# EasyEDA Pro project f4_ui.eprj

# Schematic Schematic1
Board Name: Board1; Create Date: 2025-08-23; Page Name: P1; Project Name: f4_ui; Schematic Name: Schematic1; Update Date: 2025-08-25; Company: 嘉立创EDA; Page Size: A4; Version: V1.0
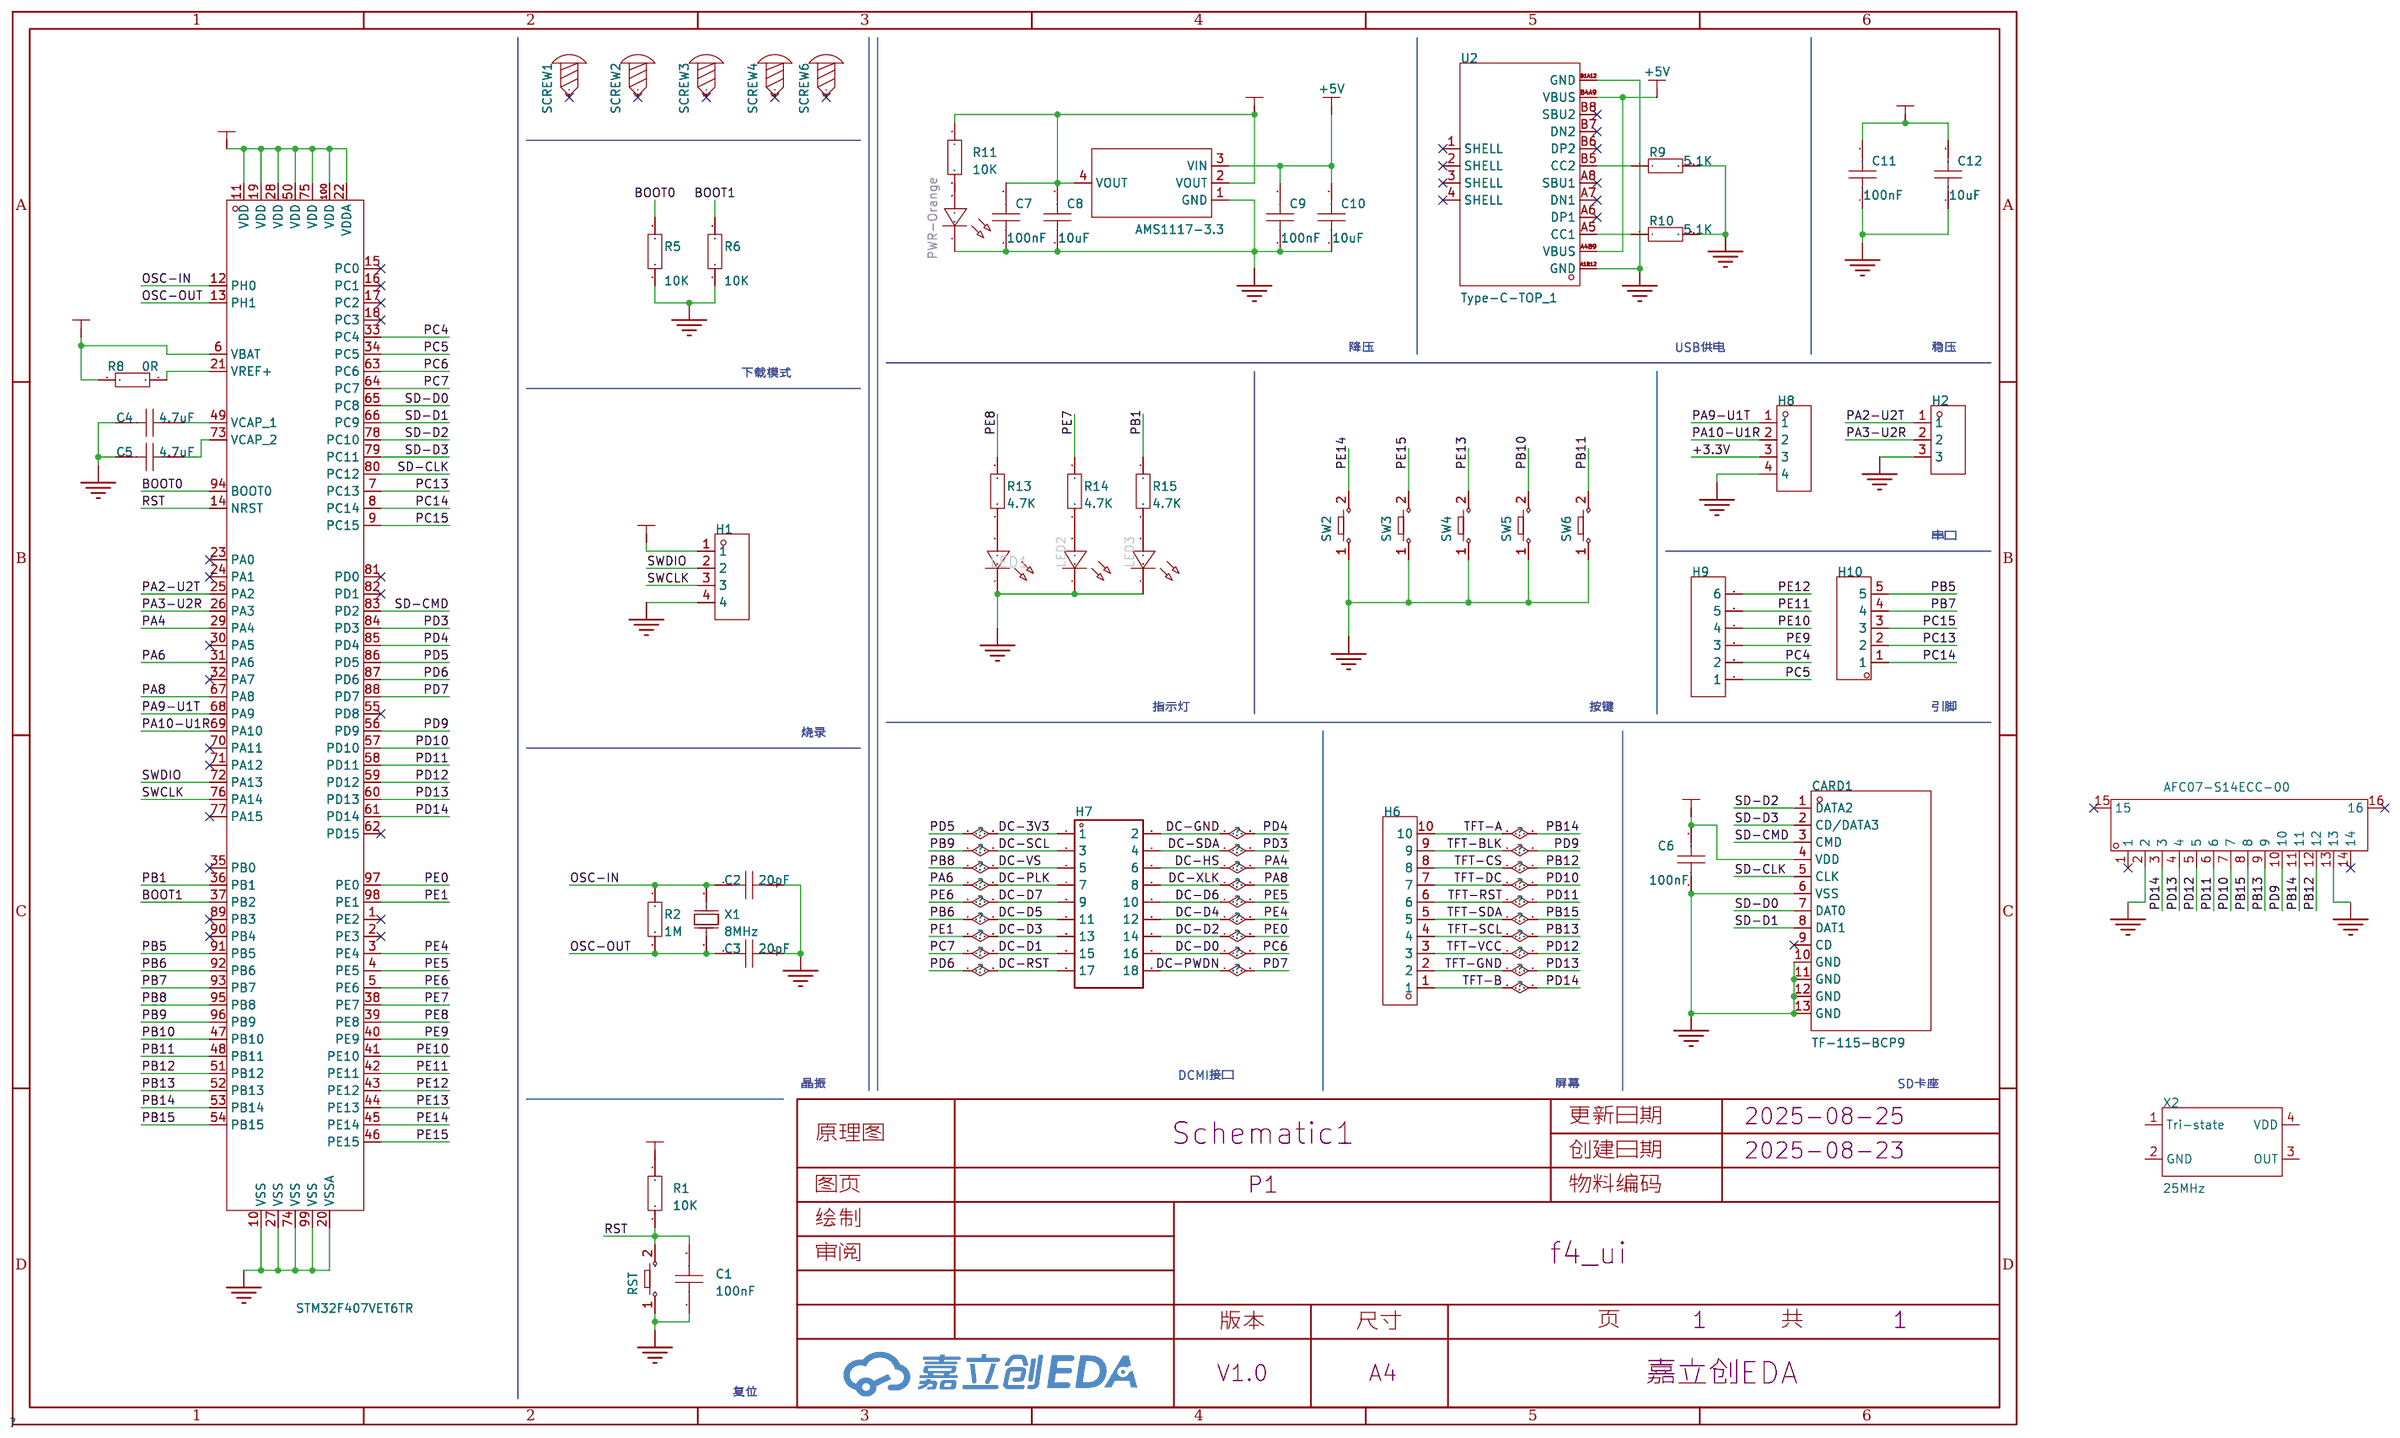
[diagram p0: schematic sheet]

## Parts
C1  100nF  [C0805]
C2  20pF  [C0805]
C3  20pF  [C0805]
C4  4.7uF  [C0805]
C5  4.7uF  [C0805]
C6  100nF  [C0805]
C7  100nF  [C0805]
C8  10uF  [C0805]
C9  100nF  [C0805]
C10  10uF  [C0805]
C11  100nF  [C0805]
C12  10uF  [C0805]
CARD1  TF-115-BCP9  [TF-SMD_TF-115-BCP9]
H1  -  [HDR-TH_4P-P2.54-V-M]
H2  -  [HDR-TH_3P-P2.54-V-F]
H6  -  [HDR-TH_10P-P2.54-V-F]
H7  -  [HDR-TH_18P-P2.54-V-F-R2-C9-S2.54-1]
H8  -  [HDR-TH_4P-P2.54-V-F]
H9  -  [HDR-TH_6P-P2.54-V-M-1]
H10  -  [HDR-TH_5P-P2.54-V-M]
LED1  -  [LED_0805]
LED2  -  [LED_0805]
LED3  -  [LED_0805]
P1  AFC07-S14ECC-00  [FPC-SMD_14P-L12.5-W5.4-P0.50]
PWR-Orange  -  [LED_0805]
R1  10K  [R0805]
R2  1M  [R0805]
R5  10K  [R0805]
R6  10K  [R0805]
R8  0R  [R0805]
R9  5.1K  [R0805]
R10  5.1K  [R0805]
R11  10K  [R0805]
R13  4.7K  [R0805]
R14  4.7K  [R0805]
R15  4.7K  [R0805]
RST  -  [Key_SMD_3x4x2]
SCREW1  -  [M3螺丝]
SCREW2  -  [M3螺丝]
SCREW3  -  [M3螺丝]
SCREW4  -  [M3螺丝]
SCREW6  -  [M3螺丝]
SW2  -  [Key_SMD_3x4x2]
SW3  -  [Key_SMD_3x4x2]
SW4  -  [Key_SMD_3x4x2]
SW5  -  [Key_SMD_3x4x2]
SW6  -  [Key_SMD_3x4x2]
U1  STM32F407VET6TR  [LQFP-100_L14.0-W14.0-P0.50-LS16.0-BL]
U2  Type-C-TOP_1  [USB-C-SMD_TYPE-C16PIN]
U3  AMS1117-3.3  [SOT-223-3_L6.5-W3.4-P2.30-LS7.0-BR]
X1  8MHz  [HC-49S_L11.5-W4.8]
X2  25MHz  [OSC-SMD_4P-L5.0-W3.2-BL_A]

## Library data of the parts
C1-C12 = CAP_0805: Supplier Footprint: 0805
CARD1 = TF-115-BCP9: 卡连接方式:自弹式;卡类型:MicroSD卡(TF卡);连接器类型:卡座;本体最大高度:1.8mm;工作温度范围:-25℃~+85℃;; LCSC Part Name: 自弹式 MicroSD卡(TF卡) 卡座; Supplier Part: C720505; Manufacturer: XUNPU(讯普); Supplier Footprint: SMD; JLCPCB Part Class: 扩展库; Datasheet: https://atta.szlcsc.com/upload/public/pdf/source/20210906/DBEC8F03AA1503572333C7CF4A76D0AD.pdf; Supplier: LCSC; Card Connection Mode: 自弹式; Card Type: MicroSD卡(TF卡); Connector Type: 卡座; Maximum Body Height: 1.8mm; Operating Temperature Range: -25℃~+85℃
H1 = HDR-M_2.54_1x4P: Supplier Part: C492403; Supplier Footprint: 插件
H2 = HDR-F_2.54_1x3P: Supplier Part: C541850; Supplier Footprint: 插件
H6 = HDR-F_2.54_1x10P: Supplier Part: C2684744; Supplier Footprint: 插件
H7 = HDR-F_2.54_2x9: Supplier Part: C132125; Supplier Footprint: 插件
H8 = HDR-F_2.54_1x4P: Supplier Part: C2718488; Supplier Footprint: 插件
H9 = HDR-M_2.54_1x6P: Supplier Part: C37208; Supplier Footprint: 插件
H10 = HDR-M_2.54_1x5P: Supplier Part: C358687; Supplier Footprint: 插件
LED1 = LED_0805-R: Supplier Footprint: 0805
LED2 PWR-Orange = LED_0805-G: Supplier Footprint: 0805
LED3 = LED_0805-B: Supplier Footprint: 0805
P1 = AFC07-S14ECC-00: 锁定特性:抽屉式;触点类型:上接;触点数量:14P;间距:0.5mm;安装类型:卧贴;; LCSC Part Name: 间距:0.5mm P数:14P 抽屉式 上接; Supplier Part: C11087; Manufacturer: JS(钜硕电子); Supplier Footprint: SMD,P=0.5mm,卧贴; JLCPCB Part Class: 扩展库; Datasheet: https://atta.szlcsc.com/upload/public/pdf/source/20130129/1457706582878.pdf; Supplier: LCSC; Locking Feature: 抽屉式; Contact Type: 上接; Number of Contacts: 14P; Pitch: 0.5mm; Mounting Type: 卧贴; FFC, FCB Thickness: 0.3mm; Height Above Board: 2mm
R1 R2 R5 R6 R8-R11 R13-R15 = Res_0805: Supplier Footprint: 0805
RST SW2-SW6 = Key_SMD_3x4x2: Supplier Footprint: SMD
SCREW1-SCREW4 SCREW6 = M3螺丝: Supplier Footprint: 插件
U1 = STM32F407VET6TR: CPU内核:ARM-M4;CPU最大主频:168MHz;应用领域:-;; LCSC Part Name: 带DSP和FPU的高性能基础系列ARM Cortex-M4 MCU，具有512 KB Flash、168 MHz CPU、ART加速器、以太网和FSMC; Supplier Part: C5269943; Manufacturer: ST(意法半导体); Supplier Footprint: LQFP-100(14x14); JLCPCB Part Class: 扩展库; Datasheet: https://atta.szlcsc.com/upload/public/pdf/source/20201130/C919362_39400D478C258148B3DF984CE4A4041A.pdf; Supplier: LCSC; CPU Core: ARM-M4; CPU Maximum Speed: 168MHz; Number of I/O: 82; ADC (Bit): 12bit; DAC (Bit): 12bit; Low Voltage Detection Threshold: 1.8V~3.6V
U2 = Type-C-TOP_1: Supplier Part: C9900005857; Supplier Footprint: Type-C16P; JLCPCB Part Class: 扩展库; Supplier: LCSC
U3 = AMS1117-3.3_C6186: 输出类型:固定;工作电压:-;输出电压:3.3V;输出电流:1A;电源纹波抑制比(PSRR):72dB@(120Hz);输出极性:正极;; LCSC Part Name: 输出3.3V 1A; Supplier Part: C6186; Manufacturer: AMS; Supplier Footprint: SOT-223; JLCPCB Part Class: 基础库; Datasheet: https://atta.szlcsc.com/upload/public/pdf/source/20180727/C6186_7A095716F0823C02F1997A905E26C086.pdf; Supplier: LCSC; Output Type: 固定; Output Voltage: 3.3V; Output Current: 1A; Power Supply Rejection Ratio (PSRR): 72dB@(120Hz); Voltage Dropout: 1.3V@(800mA); Features: 过流保护(OCP)；热关断(TSD); Output Configuration: 正极; Number of Outputs: 1
X1 = 49SAT080000201060: 晶振类型:贴片晶振;频率:8MHz;常温频差:±10ppm;外接负载电容:20pF;; LCSC Part Name: 8MHz ±10ppm 20pF; Supplier Part: C390758; Manufacturer: JGHC(晶光华); Supplier Footprint: HC-49S-SMD; JLCPCB Part Class: 扩展库; Datasheet: https://atta.szlcsc.com/upload/public/pdf/source/20200102/C479159_77354EAC8C21D1127CB2E163DDA33705.pdf; Supplier: LCSC; Crystal Type: 贴片晶振; Normal temperature Frequency Tolerance: ±10ppm; External load capacitor: 20pF; Operating Temperature: -20℃~+70℃
X2 = OT503225MJBA4SL: LCSC Part Name: YSO110TR 25MHZ 4P 5032 1.8V-3.3V ±10PPM -40~85℃（±20PPM) CMOS; Supplier Part: C717795; Manufacturer: YXC(扬兴晶振); Supplier Footprint: SMD5032-4P; JLCPCB Part Class: 扩展库; Datasheet: https://item.szlcsc.com/datasheet/OT503225MJBA4SL/758655.html; Supplier: LCSC; Normal temperature Frequency Tolerance: ±10ppm; Output Type: CMOS; Voltage - Supply: 1.8V~3.3V; Frequency Stability: ±20ppm; Operating Temperature: -40℃~+85℃

## Nets
+3.3V: C6.2 C7.2 C8.2 C11.2 C12.2 CARD1.4(VDD) H1.1 H8.3 R1.2 R8.1 R11.1 U1.6(VBAT) U1.11(VDD) U1.19(VDD) U1.22(VDDA) U1.28(VDD) U1.50(VDD) U1.75(VDD) U1.100(VDD) U3.2(VOUT) U3.4(VOUT)
+5V: C9.2 C10.2 U2.A4B9(VBUS) U2.B4A9(VBUS) U3.3(VIN)
GND: C1.1 C2.2 C3.2 C4.1 C5.1 C6.1 C7.1 C8.1 C9.1 C10.1 C11.1 C12.1 CARD1.6(VSS) CARD1.10(GND) CARD1.11(GND) CARD1.12(GND) CARD1.13(GND) H1.4 H2.3 H8.4 LED1.1(C) LED2.1(C) LED3.1(C) P1.2 P1.13 PWR-Orange.1(C) R5.1 R6.1 R9.2 R10.2 RST.1 SW2.1 SW3.1 SW4.1 SW5.1 SW6.1 U1.10(VSS) U1.20(VSSA) U1.27(VSS) U1.74(VSS) U1.99(VSS) U2.A1B12(GND) U2.B1A12(GND) U3.1(GND)
BOOT0: R5.2 U1.94(BOOT0)
BOOT1: R6.2 U1.37(PB2)
DC-3V3: H7.1 U1.86(PD5)
DC-D0: H7.16 U1.63(PC6)
DC-D1: H7.15 U1.64(PC7)
DC-D2: H7.14 U1.97(PE0)
DC-D3: H7.13 U1.98(PE1)
DC-D4: H7.12 U1.3(PE4)
DC-D5: H7.11 U1.92(PB6)
DC-D6: H7.10 U1.4(PE5)
DC-D7: H7.9 U1.5(PE6)
DC-GND: H7.2 U1.85(PD4)
DC-HS: H7.6 U1.29(PA4)
DC-PLK: H7.7 U1.31(PA6)
DC-PWDN: H7.18 U1.88(PD7)
DC-RST: H7.17 U1.87(PD6)
DC-SCL: H7.3 U1.96(PB9)
DC-SDA: H7.4 U1.84(PD3)
DC-VS: H7.5 U1.95(PB8)
DC-XLK: H7.8 U1.67(PA8)
OSC-IN: C2.1 R2.2 U1.12(PH0) X1.2(OSC2)
OSC-OUT: C3.1 R2.1 U1.13(PH1) X1.1(OSC1)
PA2-U2T: H2.1 U1.25(PA2)
PA3-U2R: H2.2 U1.26(PA3)
PA9-U1T: H8.1 U1.68(PA9)
PA10-U1R: H8.2 U1.69(PA10)
PB1: R15.2 U1.36(PB1)
PB5: H10.5 U1.91(PB5)
PB7: H10.4 U1.93(PB7)
PB10: SW5.2 U1.47(PB10)
PB11: SW6.2 U1.48(PB11)
PB12: H6.8 P1.12 U1.51(PB12)
PB13: H6.4 P1.9 U1.52(PB13)
PB14: H6.10 P1.11 U1.53(PB14)
PB15: H6.5 P1.8 U1.54(PB15)
PC4: H9.2 U1.33(PC4)
PC5: H9.1 U1.34(PC5)
PC13: H10.2 U1.7(PC13)
PC14: H10.1 U1.8(PC14)
PC15: H10.3 U1.9(PC15)
PD9: H6.9 P1.10 U1.56(PD9)
PD10: H6.7 P1.7 U1.57(PD10)
PD11: H6.6 P1.6 U1.58(PD11)
PD12: H6.3 P1.5 U1.59(PD12)
PD13: H6.2 P1.4 U1.60(PD13)
PD14: H6.1 P1.3 U1.61(PD14)
PE7: R14.2 U1.38(PE7)
PE8: R13.2 U1.39(PE8)
PE9: H9.3 U1.40(PE9)
PE10: H9.4 U1.41(PE10)
PE11: H9.5 U1.42(PE11)
PE12: H9.6 U1.43(PE12)
PE13: SW4.2 U1.44(PE13)
PE14: SW2.2 U1.45(PE14)
PE15: SW3.2 U1.46(PE15)
RST: C1.2 R1.1 RST.2 U1.14(NRST)
SD-CLK: CARD1.5(CLK) U1.80(PC12)
SD-CMD: CARD1.3(CMD) U1.83(PD2)
SD-D0: CARD1.7(DAT0) U1.65(PC8)
SD-D1: CARD1.8(DAT1) U1.66(PC9)
SD-D2: CARD1.1(DATA2) U1.78(PC10)
SD-D3: CARD1.2(CD/DATA3) U1.79(PC11)
SWCLK: H1.3 U1.76(PA14)
SWDIO: H1.2 U1.72(PA13)
$1N655: R8.2 U1.21(VREF+)
$1N662: C4.2 U1.49(VCAP_1)
$1N663: C5.2 U1.73(VCAP_2)
$1N4147: R9.1 U2.B5(CC2)
$1N4148: R10.1 U2.A5(CC1)
$1N4676: PWR-Orange.2(A) R11.2
$1N5858: LED2.2(A) R14.1
$1N5884: LED3.2(A) R15.1
$1N5886: LED1.2(A) R13.1

Not connected (* = marked no-connect by the designer): CARD1 9(CD)*; P1 1* 14* 15* 16*; SCREW1 1*; SCREW2 1*; SCREW3 1*; SCREW4 1*; SCREW6 1*; U1 1(PE2)* 2(PE3)* 15(PC0)* 16(PC1)* 17(PC2)* 18(PC3)* 23(PA0)* 24(PA1)* 30(PA5)* 32(PA7)* 35(PB0)* 55(PD8)* 62(PD15)* 70(PA11)* 71(PA12)* 77(PA15)* 81(PD0)* 82(PD1)* 89(PB3)* 90(PB4)*; U2 1(SHELL)* 2(SHELL)* 3(SHELL)* 4(SHELL)* A6(DP1)* A7(DN1)* A8(SBU1)* B6(DP2)* B7(DN2)* B8(SBU2)*; X2 1(Tri-state) 2(GND) 3(OUT) 4(VDD)

## Notes on the sheet
- 降压
- USB供电
- 稳压
- 下载模式
- 串口
- 指示灯
- 按键
- 引脚
- 烧录
- 晶振
- DCMI接口
- 屏幕
- SD卡座
- 复位

# Board PCB1
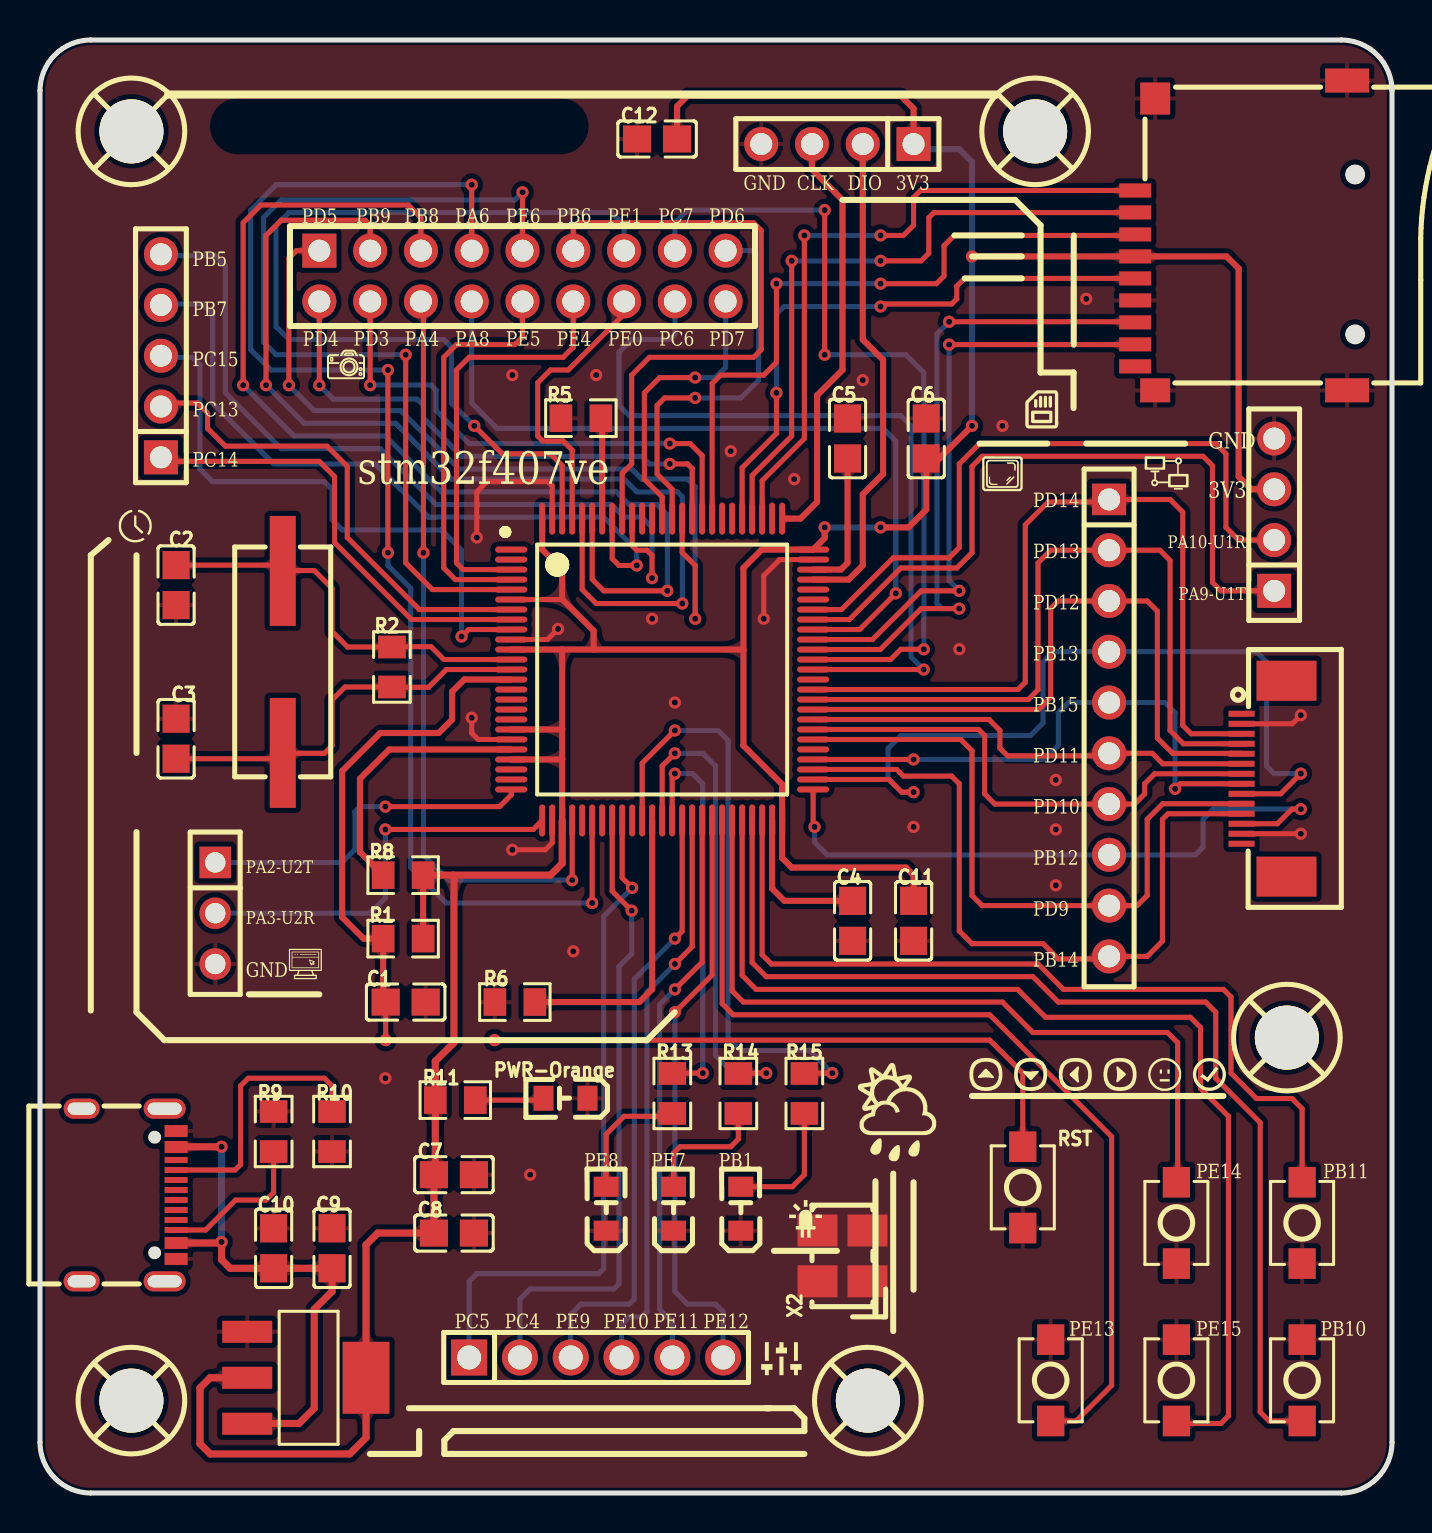
[diagram p1: board, top side]
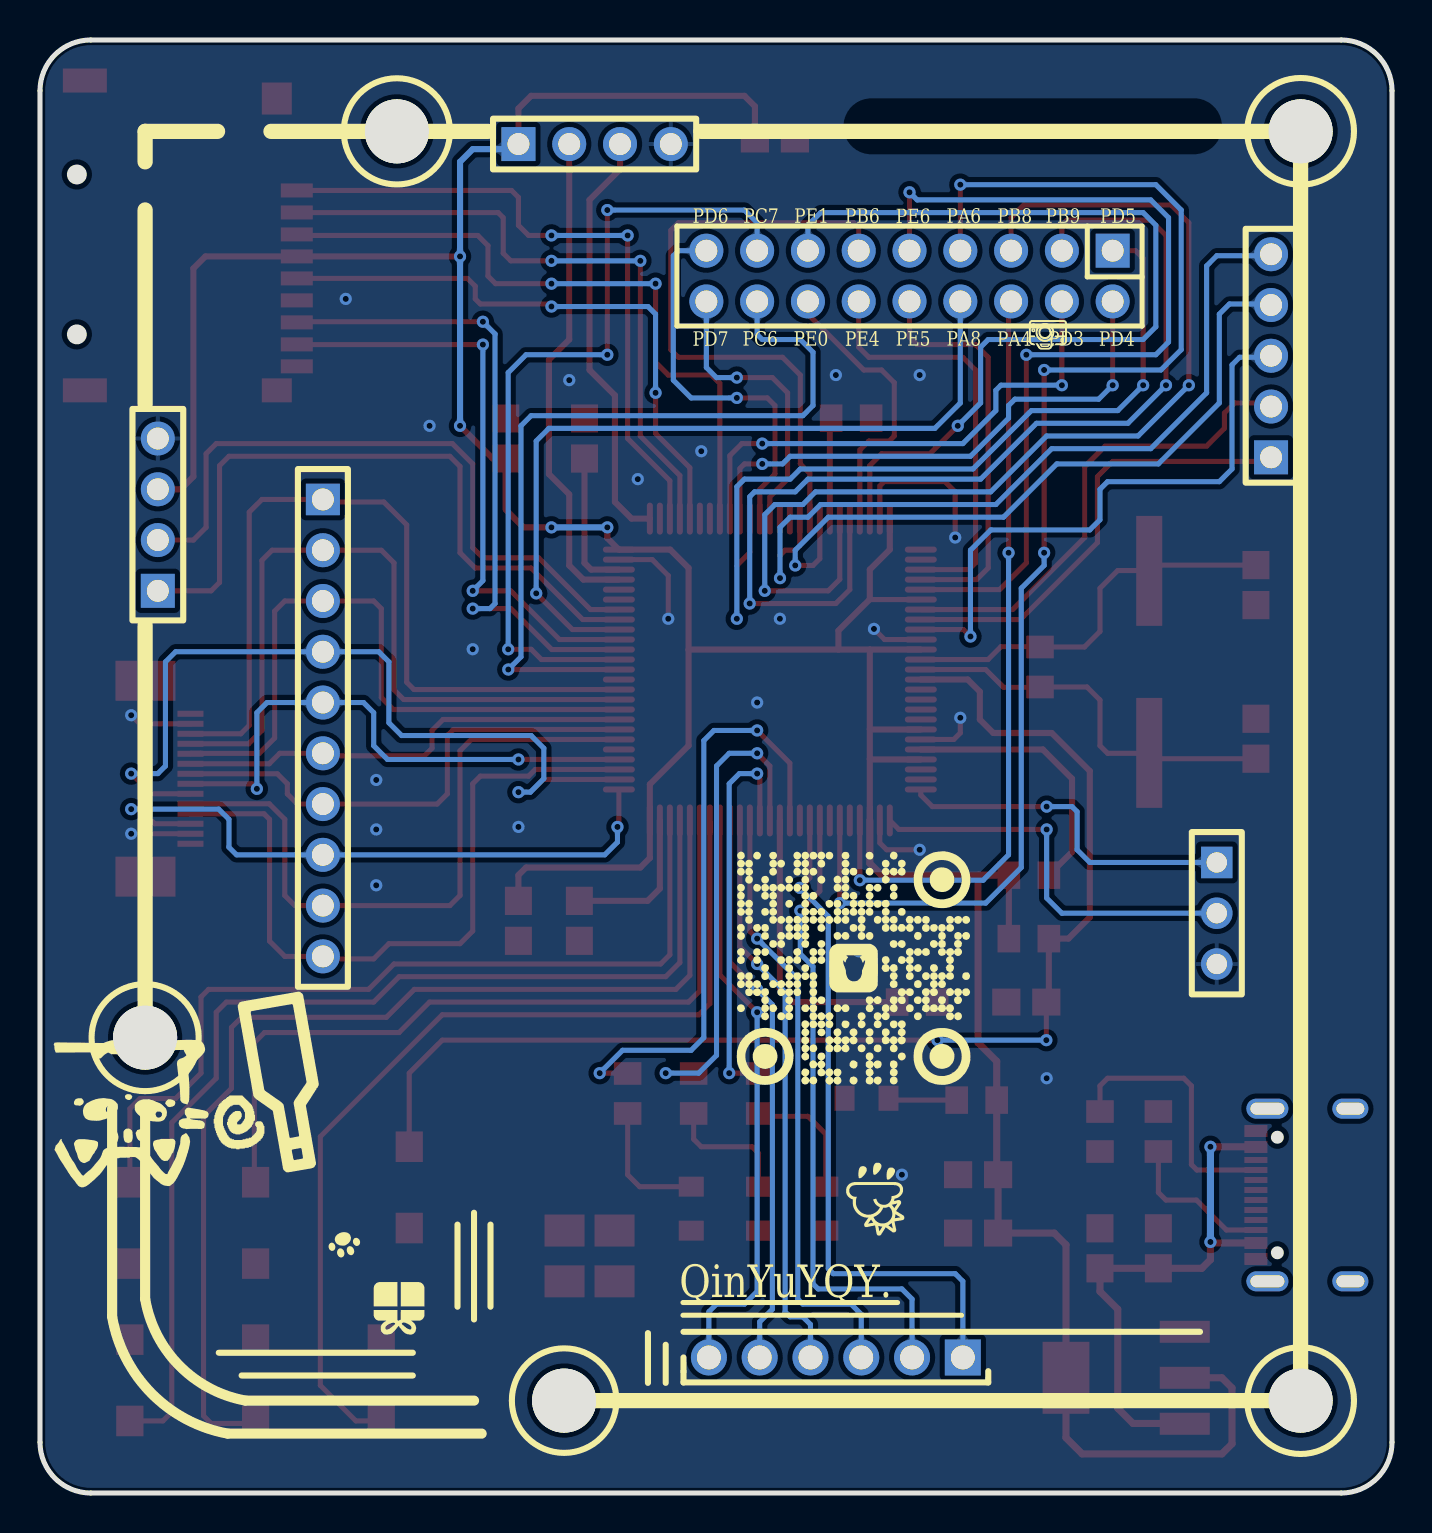
[diagram p2: board, bottom side, seen from below]

Outline 67.62 x 72.69 mm; copper layers: Top Layer, Bottom Layer. Coordinates in mm from the lower left corner of the outline.
Outline path: 0,70.15 0,2.54 arc(0.74,0.74) 2.54,0 65.07,0 arc(66.87,0.74) 67.62,2.54 67.62,70.15 arc(66.87,71.95) 65.07,72.69 2.54,72.69 arc(0.74,71.95) 0,70.15
Stack: Top Layer 0.035mm / Dielectric1 1.51mm FR4 er 4.5 / Bottom Layer 0.035mm

## Design rules (mm)
net OSC-IN: DP1
net OSC-OUT: DP1
template: 自定义配置
spacing copperThickness1oz (default): track to track 0.102, other pairs 0.102 to 0.3
spacing copperThickness2oz: track to track 0.203, other pairs 0.152 to 0.3
track width copperThickness1oz (default): min 0.127, default 0.254, max 2.54
track width copperThickness2oz: min 0.203, default 0.254, max 2.54
differential pair differentialPair (default): width min 0.127, default 0.254, max 2.54; gap min 0.152, default 0.152
via viaSize (default): diameter min 0.5, default 0.61, max 10; hole min 0.3, default 0.305, max 6.299

## Placement (name value [footprint] x y rotation side)
C1  100nF  [C0805]  18.29 24.56 180 top
C2  20pF  [C0805]  6.81 45.42 270 top
C3  20pF  [C0805]  6.81 37.74 90 top
C4  4.7uF  [C0805]  40.64 28.63 90 top
C5  4.7uF  [C0805]  40.39 52.76 270 top
C6  100nF  [C0805]  44.32 52.76 270 top
C7  100nF  [C0805]  20.7 15.93 180 top
C8  10uF  [C0805]  20.7 13 180 top
C9  100nF  [C0805]  14.61 12.24 270 top
C10  10uF  [C0805]  11.68 12.24 270 top
C11  100nF  [C0805]  43.69 28.63 90 top
C12  10uF  [C0805]  30.86 67.74 0 top
CARD1  TF-115-BCP9  [TF-SMD_TF-115-BCP9]  60.07 62.92 90 top
H1  -  [HDR-TH_4P-P2.54-V-M]  39.88 67.49 180 top
H2  -  [HDR-TH_3P-P2.54-V-F]  8.76 29.01 270 top
H6  -  [HDR-TH_10P-P2.54-V-F]  53.47 38.28 270 top
H7  -  [HDR-TH_18P-P2.54-V-F-R2-C9-S2.54-1]  24.13 60.88 0 bottom
H8  -  [HDR-TH_4P-P2.54-V-F]  61.72 48.95 90 top
H9  -  [HDR-TH_6P-P2.54-V-M-1]  27.81 6.78 0 top
H10  -  [HDR-TH_5P-P2.54-V-M]  6.05 56.9 90 top
LED1  -  [LED_0805]  28.32 14.28 90 top
LED2  -  [LED_0805]  31.69 14.28 90 top
LED3  -  [LED_0805]  35.05 14.28 90 top
P1  AFC07-S14ECC-00  [FPC-SMD_14P-L12.5-W5.4-P0.50]  61.21 35.74 90 top
PWR-Orange  -  [LED_0805]  26.23 19.76 180 top
R1  10K  [R0805]  18.16 27.74 0 top
R2  1M  [R0805]  17.6 41.33 90 top
R5  10K  [R0805]  27.05 53.77 0 top
R6  10K  [R0805]  23.75 24.56 0 top
R8  0R  [R0805]  18.16 30.91 180 top
R9  5.1K  [R0805]  11.68 18.08 90 top
R10  5.1K  [R0805]  14.61 18.08 270 top
R11  10K  [R0805]  20.77 19.66 0 top
R13  4.7K  [R0805]  31.62 19.99 90 top
R14  4.7K  [R0805]  34.93 19.99 90 top
R15  4.7K  [R0805]  38.23 19.99 90 top
RST  -  [Key_SMD_3x4x2]  49.15 15.29 90 top
SCREW1  -  [M3螺丝]  4.57 4.62 0 top
SCREW2  -  [M3螺丝]  62.36 22.78 0 top
SCREW3  -  [M3螺丝]  49.77 68.12 0 top
SCREW4  -  [M3螺丝]  4.57 68.12 0 top
SCREW6  -  [M3螺丝]  41.4 4.62 0 top
SW2  -  [Key_SMD_3x4x2]  56.83 13.51 90 top
SW3  -  [Key_SMD_3x4x2]  56.83 5.64 270 top
SW4  -  [Key_SMD_3x4x2]  50.55 5.64 270 top
SW5  -  [Key_SMD_3x4x2]  63.12 5.64 270 top
SW6  -  [Key_SMD_3x4x2]  63.12 13.51 90 top
U1  STM32F407VET6TR  [LQFP-100_L14.0-W14.0-P0.50-LS16.0-BL]  31.12 41.2 270 top
U2  Type-C-TOP_1  [USB-C-SMD_TYPE-C16PIN]  4.44 14.91 270 top
U3  AMS1117-3.3  [SOT-223-3_L6.5-W3.4-P2.30-LS7.0-BR]  13.33 5.77 180 top
X1  8MHz  [HC-49S_L11.5-W4.8]  12.14 41.58 270 top
X2  25MHz  [OSC-SMD_4P-L5.0-W3.2-BL_A]  40.13 11.86 90 top

## Footprints (pads in the part's own frame, mm; a bottom-side part is the same pattern mirrored in y, then rotated)
C0805
  rect 1.41x1.35 smd: 1(-1,0) 2(1,0)
FPC-SMD_14P-L12.5-W5.4-P0.50
  rect 0.3x1.3 smd: 1(3.249,1.125) 2(2.745,1.125) 3(2.245,1.125) 4(1.745,1.125) 5(1.245,1.125) 6(0.745,1.125) 7(0.245,1.125) 8(-0.255,1.125) 9(-0.755,1.125) 10(-1.255,1.125) 11(-1.755,1.125) 12(-2.255,1.125) 13(-2.755,1.125) 14(-3.255,1.125)
  rect 2x3 smd: 15(-4.901,-1.125) 16(4.901,-1.125)
HC-49S_L11.5-W4.8
  rect 5.5x1.3 smd: 1(4.553,0) 2(-4.553,0)
HDR-TH_3P-P2.54-V-F
  rect 1.575x1.575 hole 1.02: 1(-2.54,0)
  round 1.575 hole 1.02: 2(0,0) 3(2.54,0)
HDR-TH_4P-P2.54-V-F
  rect 1.7x1.7 hole 1.1: 1(-3.81,0)
  round 1.7 hole 1.1: 2(-1.27,0) 3(1.27,0) 4(3.81,0)
HDR-TH_4P-P2.54-V-M
  rect 1.7x1.7 hole 1.1: 1(-3.81,0)
  round 1.7 hole 1.1: 2(-1.27,0) 3(1.27,0) 4(3.81,0)
HDR-TH_5P-P2.54-V-M
  rect 1.7x1.7 hole 1.1: 1(-5.08,0)
  round 1.7 hole 1.1: 2(-2.54,0) 3(0,0) 4(2.54,0) 5(5.08,0)
HDR-TH_6P-P2.54-V-M-1
  rect 1.8x1.8 hole 1.2: 1(-6.35,0)
  round 1.8 hole 1.2: 2(-3.81,0) 3(-1.27,0) 4(1.27,0) 5(3.81,0) 6(6.35,0)
HDR-TH_10P-P2.54-V-F
  rect 1.575x1.7 hole 1.1: 1(-11.43,0)
  round 1.7 hole 1.1: 2(-8.89,0) 3(-6.35,0) 4(-3.81,0) 5(-1.27,0) 6(1.27,0) 7(3.81,0) 8(6.35,0) 9(8.89,0) 10(11.43,0)
HDR-TH_18P-P2.54-V-F-R2-C9-S2.54-1
  rect 1.7x1.7 hole 1.1: 1(-10.16,-1.27)
  round 1.7 hole 1.1: 2(-10.16,1.27) 3(-7.62,-1.27) 4(-7.62,1.27) 5(-5.08,-1.27) 6(-5.08,1.27) 7(-2.54,-1.27) 8(-2.54,1.27) 9(0,-1.27) 10(0,1.27) 11(2.54,-1.27) 12(2.54,1.27) 13(5.08,-1.27) 14(5.08,1.27) 15(7.62,-1.27) 16(7.62,1.27) 17(10.16,-1.27) 18(10.16,1.27)
Key_SMD_3x4x2
  rect 1.53x1.36 smd: 1(-2.035,0) 2(2.035,0)
LED_0805
  rect 1x1.25 smd: 1(-1.15,0.005) 2(1.05,0.005)
LQFP-100_L14.0-W14.0-P0.50-LS16.0-BL
  oval 0.3x1.6 smd: 1(-6,-7.55) 2(-5.5,-7.55) 3(-5,-7.55) 4(-4.5,-7.55) 5(-4,-7.55) 6(-3.5,-7.55) 7(-3,-7.55) 8(-2.5,-7.55) 9(-2,-7.55) 10(-1.5,-7.55) 11(-1,-7.55) 12(-0.5,-7.55) 13(0,-7.55) 14(0.5,-7.55) 15(1,-7.55) 16(1.5,-7.55) 17(2,-7.55) 18(2.5,-7.55) 19(3,-7.55) 20(3.5,-7.55) 21(4,-7.55) 22(4.5,-7.55) 23(5,-7.55) 24(5.5,-7.55) 25(6,-7.55) 51(6,7.55) 52(5.5,7.55) 53(5,7.55) 54(4.5,7.55) 55(4,7.55) 56(3.5,7.55) 57(3,7.55) 58(2.5,7.55) 59(2,7.55) 60(1.5,7.55) 61(1,7.55) 62(0.5,7.55) 63(0,7.55) 64(-0.5,7.55) 65(-1,7.55) 66(-1.5,7.55) 67(-2,7.55) 68(-2.5,7.55) 69(-3,7.55) 70(-3.5,7.55) 71(-4,7.55) 72(-4.5,7.55) 73(-5,7.55) 74(-5.5,7.55) 75(-6,7.55)
  oval 1.6x0.3 smd: 26(7.55,-6) 27(7.55,-5.5) 28(7.55,-5) 29(7.55,-4.5) 30(7.55,-4) 31(7.55,-3.5) 32(7.55,-3) 33(7.55,-2.5) 34(7.55,-2) 35(7.55,-1.5) 36(7.55,-1) 37(7.55,-0.5) 38(7.55,0) 39(7.55,0.5) 40(7.55,1) 41(7.55,1.5) 42(7.55,2) 43(7.55,2.5) 44(7.55,3) 45(7.55,3.5) 46(7.55,4) 47(7.55,4.5) 48(7.55,5) 49(7.55,5.5) 50(7.55,6) 76(-7.55,6) 77(-7.55,5.5) 78(-7.55,5) 79(-7.55,4.5) 80(-7.55,4) 81(-7.55,3.5) 82(-7.55,3) 83(-7.55,2.5) 84(-7.55,2) 85(-7.55,1.5) 86(-7.55,1) 87(-7.55,0.5) 88(-7.55,0) 89(-7.55,-0.5) 90(-7.55,-1) 91(-7.55,-1.5) 92(-7.55,-2) 93(-7.55,-2.5) 94(-7.55,-3) 95(-7.55,-3.5) 96(-7.55,-4) 97(-7.55,-4.5) 98(-7.55,-5) 99(-7.55,-5.5) 100(-7.55,-6)
M3螺丝
  round 3.2 hole 3.2: 1(0,0)
OSC-SMD_4P-L5.0-W3.2-BL_A
  rect 1.6x2 smd: 1(-1.27,-1.25) 2(1.27,-1.25) 3(1.27,1.25) 4(-1.27,1.25)
R0805
  rect 1.133x1.377 smd: 1(-1,0) 2(1,0)
SOT-223-3_L6.5-W3.4-P2.30-LS7.0-BR
  rect 2.5x1.1 smd: 1(2.97,-2.3) 2(2.97,0) 3(2.97,2.3)
  rect 2.34x3.6 smd: 4(-2.97,0)
TF-SMD_TF-115-BCP9
  rect 0.7x1.6 smd: 1(2.25,5.3) 2(1.15,5.3) 3(0.05,5.3) 4(-1.05,5.3) 5(-2.15,5.3) 6(-3.25,5.3) 7(-4.35,5.3) 8(-5.45,5.3) 9(-6.55,5.3)
  rect 1.2x1.5 smd: 10(-7.75,4.3)
  rect 1.2x2.2 smd: 11(-7.75,-5.3) 13(7.75,-5.3)
  rect 1.6x1.5 smd: 12(6.85,4.3)
USB-C-SMD_TYPE-C16PIN
  oval 1x2.1 hole 0.6x1.7: 1(-4.32,1.788) 2(4.32,1.788)
  oval 1x1.8 hole 0.6x1.4: 3(-4.32,-2.362) 4(4.32,-2.362)
  rect 0.6x1.15 smd: A1B12(-3.2,2.362) A4B9(-2.4,2.362) B1A12(3.2,2.362) B4A9(2.4,2.362)
  rect 0.3x1.15 smd: A5(-1.25,2.362) A6(-0.25,2.362) A7(0.25,2.362) A8(1.25,2.362) B5(1.75,2.362) B6(0.75,2.362) B7(-0.75,2.362) B8(-1.75,2.362)

## Nets
As in the schematic.

Pads without a net: CARD1 9; P1 1 14 15 16; SCREW1 1; SCREW2 1; SCREW3 1; SCREW4 1; SCREW6 1; U1 1 2 15 16 17 18 23 24 30 32 35 55 62 70 71 77 81 82 89 90; U2 1 2 3 4 A6 A7 A8 B6 B7 B8; X2 1 2 3 4

## Via types
v1: diameter 0.61, hole 0.305, Top Layer to Bottom Layer, 93 vias

## Routing (per net, layer and track width the routed paths; a pad name or vN(x,y) marks a point on that pad's centre or on a via; arc(x,y) is an arc through that point)
+3.3V: length 191.8
  Top Layer w0.254: 26.12,44.71 26.1,44.7 U1.6
  Top Layer w0.305: 26.12,42.2 27.69,42.2 ; 26.12,42.2 U1.11 ; 26.12,42.2 26.12,38.21 ; 27.69,42.2 35.16,42.2 35.18,42.18 ; 27.69,42.2 27.69,43.14 26.12,44.71 26.12,46.2 25.12,47.2 U1.100 ; 26.12,36.72 26.12,38.21 ; 26.12,36.72 26.09,36.7 U1.22 ; 26.12,36.72 U1.28 ; 26.12,38.21 26.1,38.2 U1.19 ; H8.3 60.58,50.22 59.94,50.85 59.94,61.26 59.34,61.87 CARD1.4 v1(46.61,61.87) ; v1(39.24,48.31) 39.24,47.78 38.66,47.2 36.1,47.2 35.18,46.28 35.18,42.18 ; C12.2 31.86,69.38 32.38,69.9 43.05,69.9 43.69,69.27 H1.1 ; 35.18,42.18 35.18,37.39 37.12,35.45 U1.50 37.12,31.77 37.59,31.29 43.31,31.29 43.69,30.91 C11.2 ; v1(42.04,48.31) 43.43,48.31 44.32,49.2 C6.2 44.97,51.76 v1(46.61,53.39) ; R8.1 R1.2
  Top Layer w0.355: 20.67,30.91 20.7,30.88 20.7,22.53 19.77,21.6 R11.1 19.77,15.99 C7.2 C8.2 16.89,13 16.31,12.42 U3.4 16.31,2.77 15.49,1.96 8.51,1.96 8,2.46 8,5.26 8.51,5.77 U3.2 ; 20.67,30.91 R8.1 ; 20.67,30.91 25.53,30.91 26.12,31.5 U1.28
  Bottom Layer w0.305: H1.1 43.94,67.23 45.97,67.23 46.61,66.6 v1(46.61,61.87) v1(46.61,53.39) ; v1(42.04,48.31) v1(39.24,48.31)
+5V: length 27
  Top Layer w0.355: U3.3 10.38,3.48 12.95,3.48 13.72,4.24 13.72,9.19 14.61,10.08 C9.2 C10.2 9.51,11.24 9.08,11.67 v1(9.08,12.56) 9.03,12.51 U2.B4A9 ; U2.A4B9 6.82,17.32 v1(9.08,17.32)
  Bottom Layer w0.355: v1(9.08,12.56) v1(9.08,17.32)
GND: length 27.8
  Top Layer w0.254: U1.10 25.38,42.7 v1(25.91,43.23) ; P1.2 62.63,38.48 v1(63.06,38.91) ; v1(21.84,47.8) 21.84,50.09 22.35,50.6 25.4,50.6 25.62,50.38 U1.99 ; U1.27 25.62,32.52 25.27,32.18 v1(23.62,32.18) ; v1(36.19,43.74) 36.19,45.9 37,46.7 38.66,46.7 ; v1(21.59,38.79) 21.59,38.02 21.91,37.7 U1.20 ; P1.13 v1(63.06,32.98)
  vias: v1(17.27,20.75) v1(23.62,55.93) v1(24.51,15.93) v1(26.67,27.1) v1(27.81,55.93) v1(30.61,43.74) v1(31.75,39.55) v1(34.54,52.12) v1(37.72,50.72) v1(41.15,55.68) v1(43.69,33.32) v1(45.97,42.21) v1(48.13,53.39) v1(50.8,35.67) v1(50.8,33.2) v1(50.8,30.4) v1(52.32,59.74)
BOOT0: length 5
  Top Layer w0.305: U1.94 28.12,53.71 R5.2
BOOT1: length 14.6
  Top Layer w0.305: U1.37 30.62,25.2 29.97,24.56 R6.2
DC-3V3: length 42.3
  Top Layer w0.254: v1(32.77,43.74) 32.77,46.41 32.12,47.06 U1.86 ; v1(12.45,55.42) 12.45,61.77 12.83,62.15 13.97,62.15
  Bottom Layer w0.254: v1(32.77,43.74) 32.77,50.34 32.38,50.72 30.1,50.72 29.59,51.23 20.96,51.23 18.03,54.15 13.72,54.15 v1(12.45,55.42)
DC-D0: length 40.5
  Top Layer w0.254: 38.66,41.2 v1(44.2,41.2)
  Bottom Layer w0.254: H7.16 31.75,57.96 31.5,57.71 29.59,57.71 28.96,57.07 28.96,54.41 29.46,53.9 43.05,53.9 43.56,53.39 43.56,41.83 v1(44.2,41.2)
DC-D1: length 41.3
  Top Layer w0.254: v1(44.2,42.21) 43.05,42.21 42.54,41.7 38.66,41.7 ; v1(39.24,56.95) v1(39.24,64.19)
  Bottom Layer w0.254: v1(39.24,64.19) 32.38,64.19 31.75,63.55 31.75,62.15 ; v1(39.24,56.95) 43.31,56.95 44.2,56.05 v1(44.2,42.21)
DC-D2: length 14.5
  Top Layer w0.254: U1.97 26.62,52.18 26.16,52.63 25.15,52.63 24.89,52.88 24.89,55.55 25.53,56.18 26.42,56.18 29.21,58.98 H7.14
DC-D3: length 45.7
  Top Layer w0.254: U1.98 26.12,51.41 25.53,51.99 23.11,51.99 v1(21.72,53.39)
  Bottom Layer w0.254: 29.21,62.15 29.21,63.42 28.57,64.06 12.45,64.06 11.81,63.42 11.81,58.34 12.45,57.71 20.19,57.71 20.57,57.33 20.57,54.53 v1(21.72,53.39)
DC-D4: length 21.1
  Top Layer w0.254: H7.12 26.67,57.33 26.16,56.82 21.46,56.82 20.83,56.18 20.83,46.53 21.16,46.2 U1.3
DC-D5: length 31.2
  Top Layer w0.254: 26.67,62.15 26.67,63.3 26.92,63.55 35.69,63.55 36.07,63.17 36.07,57.2 35.69,56.82 30.48,56.82 29.59,55.93 29.59,51.49 29.12,51.01 U1.92
DC-D6: length 20.3
  Top Layer w0.254: H7.10 24.13,57.84 23.75,57.45 20.83,57.45 20.19,56.82 20.19,46.28 20.77,45.7 U1.4
DC-D7: length 46.2
  Top Layer w0.254: v1(18.29,56.95) 18.29,46.53 19.62,45.2 U1.5 ; v1(24.13,65.07) 24.13,62.15
  Bottom Layer w0.254: v1(24.13,65.07) 23.75,64.69 12.06,64.69 11.18,63.8 11.18,57.58 11.81,56.95 v1(18.29,56.95)
DC-GND: length 27.4
  Top Layer w0.254: v1(31.5,51.49) 32.38,51.49 32.62,51.26 U1.85 ; H7.2 v1(13.97,55.42)
  Bottom Layer w0.254: v1(13.97,55.42) 14.67,54.72 18.86,54.72 19.18,54.41 19.18,53.77 21.08,51.87 30.1,51.87 30.48,51.49 v1(31.5,51.49)
DC-HS: length 38.7
  Top Layer w0.254: U1.29 v1(26.62,30.66) ; H7.6 19.18,59.49 v1(19.18,47.04)
  Bottom Layer w0.254: v1(26.62,30.66) 20.45,30.66 19.18,31.93 v1(19.18,47.04)
DC-PLK: length 68.4
  Top Layer w0.254: U1.31 v1(27.62,29.51) ; v1(17.4,47.04) v1(17.4,56.18) ; 21.59,62.15 v1(21.59,65.46)
  Bottom Layer w0.254: v1(17.4,56.18) 11.56,56.18 10.54,57.2 10.54,64.19 11.81,65.46 v1(21.59,65.46) ; v1(17.4,47.04) 17.4,46.41 18.54,45.26 18.54,31.29 20.32,29.51 v1(27.62,29.51)
DC-PWDN: length 14.6
  Top Layer w0.254: U1.88 31.12,49.83 30.23,50.72 30.23,55.04 30.99,55.8 v1(32.77,55.8)
  Bottom Layer w0.254: H7.18 34.29,56.31 33.78,55.8 v1(32.77,55.8)
DC-RST: length 19.6
  Top Layer w0.254: U1.87 31.62,50.22 30.86,50.98 30.86,54.41 31.24,54.79 v1(32.77,54.79)
  Bottom Layer w0.254: v1(32.77,54.79) 35.05,54.79 35.94,55.68 35.94,61.9 35.69,62.15 34.29,62.15
DC-SCL: length 51.7
  Top Layer w0.254: U1.96 27.12,45.2 27.81,44.5 v1(32.12,44.5) ; v1(11.3,55.42) 11.3,62.92 12.06,63.68 16.26,63.68 16.51,63.42 16.51,62.15
  Bottom Layer w0.254: v1(32.12,44.5) 32.12,49.84 31.88,50.09 29.84,50.09 29.21,50.72 20.57,50.72 17.78,53.52 13.21,53.52 v1(11.3,55.42)
DC-SDA: length 26
  Top Layer w0.254: v1(31.5,52.5) 32.51,52.5 33.12,51.9 U1.84 ; H7.4 v1(16.51,55.42)
  Bottom Layer w0.254: v1(31.5,52.5) 21.46,52.5 19.81,54.15 19.81,55.17 19.56,55.42 v1(16.51,55.42)
DC-VS: length 54
  Top Layer w0.254: 19.05,62.15 19.05,63.8 18.41,64.44 11.05,64.44 10.16,63.55 v1(10.16,55.42) ; U1.95 27.62,45.71 28.19,45.14 v1(31.37,45.14)
  Bottom Layer w0.254: v1(31.37,45.14) 31.37,48.95 30.86,49.45 29.46,49.45 28.83,50.09 20.07,50.09 17.27,52.88 12.7,52.88 v1(10.16,55.42)
DC-XLK: length 39.6
  Top Layer w0.254: 38.66,43.2 40.99,43.2 v1(42.8,45.01)
  Bottom Layer w0.254: H7.8 21.59,54.53 22.86,53.26 42.16,53.26 42.8,52.63 v1(42.8,45.01)
OSC-IN: length 20
  Top Layer w0.254: U1.12 20.2,41.7 19.56,42.34 17.62,42.34 R2.2 15.38,42.33 14.61,43.1 14.61,45.26 13.72,46.15 12.16,46.15 X1.2 11.85,46.42 C2.1
OSC-OUT: length 20
  Top Layer w0.254: U1.13 20.32,41.2 19.43,40.31 17.62,40.31 R2.1 15.26,40.33 14.61,39.67 14.61,37.39 14.22,37.01 12.16,37.01 X1.1 11.85,36.74 C3.1
PA2-U2T: length 17.6
  Top Layer w0.254: v1(17.27,34.34) 22.99,34.34 23.56,34.92 U1.25
  Bottom Layer w0.254: v1(17.27,34.34) 16,34.34 15.75,34.09 15.75,32.18 15.11,31.55 H2.1
PA3-U2R: length 20.3
  Top Layer w0.254: v1(17.27,33.2) 24.66,33.2 U1.26
  Bottom Layer w0.254: v1(17.27,33.2) 17.27,29.77 16.51,29.01 H2.2
PA9-U1T: length 35.2
  Top Layer w0.254: 38.66,43.7 40.47,43.7 43.05,46.28 45.85,46.28 46.61,47.04 46.61,51.36 47.12,51.87 58.17,51.87 58.64,51.4 58.64,45.56 59.06,45.14 H8.1
PA10-U1R: length 33.1
  Top Layer w0.254: 61.72,47.68 59.94,47.68 59.31,48.31 59.31,51.99 58.8,52.5 46.99,52.5 45.97,51.49 45.97,47.29 45.47,46.79 42.67,46.79 40.08,44.2 38.66,44.2
PB1: length 30.3
  Top Layer w0.254: R15.2 38.24,21.01 v1(39.62,21.01) ; v1(31.75,38.15) 30.12,36.52 U1.36
  Bottom Layer w0.254: v1(39.62,21.01) 38.48,22.15 35.05,22.15 34.42,22.78 34.42,37.64 33.91,38.15 v1(31.75,38.15)
PB5: length 40.2
  Top Layer w0.254: U1.91 29.62,47.4 29.84,47.17 30.35,47.17 30.61,46.91 v1(30.61,45.77)
  Bottom Layer w0.254: H10.5 6.12,61.9 8.76,61.9 9.27,61.39 9.27,55.04 12.06,52.25 17.02,52.25 19.81,49.45 28.57,49.45 29.21,48.82 30.1,48.82 30.61,48.31 v1(30.61,45.77)
PB7: length 35.7
  Top Layer w0.254: U1.93 28.62,46.75 28.96,46.41 v1(29.84,46.41)
  Bottom Layer w0.254: v1(29.84,46.41) 29.84,47.17 28.19,48.82 19.43,48.82 16.76,51.49 11.68,51.49 8.64,54.53 8.64,58.98 8.13,59.49 6.1,59.49 H10.4
PB10: length 54.5
  Top Layer w0.254: U1.47 35.62,26.54 36.32,25.83 49.66,25.83 50.93,24.56 58.29,24.56 58.8,24.05 58.8,20.75 61.02,18.53 61.02,4.05 61.47,3.61 63.12,3.61 SW5.2
PB11: length 42.8
  Top Layer w0.254: U1.48 36.12,26.93 36.58,26.47 49.91,26.47 51.18,25.2 59.18,25.2 59.56,24.82 59.56,21.01 60.83,19.74 62.61,19.74 63.12,19.23 63.12,15.55
PB12: length 32.3
  Top Layer w0.254: v1(38.74,33.32) 38.66,33.39 38.66,35.2 ; v1(63.06,34.21) 62.61,34.21 61.88,33.48 P1.12
  Bottom Layer w0.254: v1(38.74,33.32) 38.74,32.56 39.37,31.93 H6.8 57.78,31.93 58.17,32.31 58.17,33.71 58.67,34.21 v1(63.06,34.21)
PB13: length 41.7
  Top Layer w0.254: 38.66,35.7 42.46,35.7 43.09,35.06 v1(43.69,35.06) ; v1(63.06,35.99) 62.05,34.98 P1.9
  Bottom Layer w0.254: v1(63.06,35.99) 61.72,35.99 61.34,36.37 61.34,41.58 60.83,42.09 H6.4 50.67,42.09 50.16,41.58 50.16,38.53 49.53,37.9 43.05,37.9 42.42,37.26 42.42,35.74 43.09,35.06 v1(43.69,35.06)
PB14: length 36.2
  Top Layer w0.254: P1.11 56.41,33.98 56.13,33.71 56.13,27.61 55.37,26.85 H6.10 53.34,26.72 50.93,26.72 50.16,27.48 46.61,27.48 45.97,28.12 45.97,35.48 45.59,35.86 43.18,35.86 42.85,36.2 38.66,36.2
PB15: length 27.7
  Top Layer w0.254: P1.8 57.02,35.48 v1(56.77,35.23) ; 38.66,36.7 v1(43.69,36.7)
  Bottom Layer w0.254: v1(56.77,35.23) 56.77,39.04 56.26,39.55 H6.5 51.44,39.55 50.93,39.04 50.93,37.39 50.24,36.7 v1(43.69,36.7)
PC4: length 32
  Top Layer w0.254: U1.33 28.62,30.11 v1(29.59,29.13)
  Bottom Layer w0.254: v1(29.59,29.13) 29.59,26.97 28.96,26.34 28.96,10.47 28.7,10.21 24.51,10.21 24,9.7 H9.2
PC5: length 34
  Top Layer w0.254: U1.34 29.12,30.78 v1(29.62,30.28)
  Bottom Layer w0.254: v1(29.62,30.28) 28.19,28.86 28.19,11.23 27.94,10.97 21.84,10.97 21.46,10.59 H9.1
PC13: length 24.4
  Top Layer w0.254: U1.7 18.97,44.2 15.37,47.8 15.37,51.36 14.35,52.38 9.27,52.38 8.38,53.26 8.38,54.03 7.87,54.53 6.23,54.53 H10.2
PC14: length 22.8
  Top Layer w0.254: U1.8 18.58,43.7 14.73,47.55 14.73,50.85 13.97,51.61 6.25,51.61 H10.1
PC15: length 30
  Top Layer w0.254: v1(21.08,42.85) 21.43,43.2 U1.9
  Bottom Layer w0.254: v1(21.08,42.85) 21.08,47.17 20.07,48.18 15.11,48.18 14.61,48.69 14.61,50.22 14.22,50.6 8.64,50.6 8,51.23 8,56.44 7.62,56.82 6.12,56.82 H10.3
PD9: length 33.4
  Top Layer w0.254: P1.10 56.15,34.48 55.37,33.71 55.37,29.9 54.86,29.39 H6.9 47.12,29.39 46.61,29.9 46.61,37.13 46.04,37.7 38.66,37.7
PD10: length 25.6
  Top Layer w0.254: P1.7 55.74,35.98 55.25,35.48 55.25,34.98 54.74,34.47 H6.7 47.75,34.47 47.24,34.98 47.24,37.9 46.94,38.2 38.66,38.2
PD11: length 23
  Top Layer w0.254: 38.66,38.7 47.46,38.7 48.01,38.15 48.01,37.26 48.39,36.88 53.34,36.88 H6.6 55.63,37.01 56.15,36.48 P1.6
PD12: length 33.2
  Top Layer w0.254: 38.66,39.2 49.94,39.2 50.55,39.8 50.55,44.25 50.93,44.63 H6.3 55.37,44.63 55.88,44.12 55.88,37.77 56.65,37 59.58,37 59.58,37.01 60.06,37.01 P1.5
PD13: length 37.2
  Top Layer w0.254: 38.66,39.7 49.43,39.7 49.91,40.18 49.91,46.53 50.55,47.17 H6.2 56.01,47.17 56.51,46.66 56.51,38.15 57.18,37.48 P1.4
PD14: length 41.1
  Top Layer w0.254: P1.3 57.57,37.98 57.15,38.4 57.15,49.07 56.51,49.71 H6.1 53.34,49.58 50.42,49.58 49.28,48.44 49.28,40.56 48.91,40.2 38.66,40.2
PE7: length 24.7
  Top Layer w0.254: U1.38 31.12,36.37 v1(31.75,37.01) ; R14.2 34.94,21.01 v1(36.32,21.01)
  Bottom Layer w0.254: v1(31.75,37.01) 33.15,37.01 33.78,36.37 33.78,21.89 34.67,21.01 v1(36.32,21.01)
PE8: length 20.1
  Top Layer w0.254: R13.2 31.64,21.01 v1(33.15,21.01) ; U1.39 31.62,35.73 31.88,35.99
  Bottom Layer w0.254: v1(31.75,35.99) 32.64,35.99 33.15,35.48 v1(33.15,21.01)
PE9: length 30.6
  Top Layer w0.254: v1(31.75,27.74) 32.12,28.1 U1.40
  Bottom Layer w0.254: v1(31.75,27.74) 29.72,25.7 29.72,9.7 29.46,9.45 27.05,9.45 26.54,8.94 26.54,6.78
PE10: length 28.7
  Top Layer w0.254: v1(31.75,26.47) 32.62,27.33 U1.41
  Bottom Layer w0.254: H9.4 29.08,8.43 29.46,8.81 30.1,8.81 30.35,9.07 30.35,25.07 v1(31.75,26.47)
PE11: length 28
  Top Layer w0.254: U1.42 33.12,26.56 v1(31.75,25.2)
  Bottom Layer w0.254: H9.5 31.62,8.56 30.99,9.19 30.99,24.43 v1(31.75,25.2)
PE12: length 29.5
  Top Layer w0.254: v1(31.75,24.05) 33.62,25.92 U1.43
  Bottom Layer w0.254: v1(31.75,24.05) 31.75,10.08 32.38,9.45 33.78,9.45 34.16,9.07 34.16,6.78
PE13: length 47.6
  Top Layer w0.254: U1.44 34.12,24.48 34.67,23.93 47.5,23.93 53.59,17.83 53.59,5.38 51.82,3.61 50.55,3.61 SW4.2
PE14: length 38.9
  Top Layer w0.254: U1.45 34.62,25.13 35.18,24.56 48.13,24.56 49.66,23.04 56.39,23.04 56.9,22.53 56.9,15.61 56.83,15.55
PE15: length 54.6
  Top Layer w0.254: U1.46 35.12,25.9 35.81,25.2 48.9,25.2 50.29,23.8 57.53,23.8 58.04,23.29 58.04,20.24 59.44,18.85 59.44,3.86 59.06,3.48 56.96,3.48 SW3.2
RST: length 62.3
  Top Layer w0.254: v1(22.73,22.66) 47.5,22.66 49.15,21.01 RST.2 ; C1.2 v1(17.29,22.66)
  Top Layer w0.305: C1.2 17.16,24.69 R1.1 16.18,27.74 15.11,28.8 15.11,36.12 17.02,38.02 19.94,38.02 20.61,38.7 20.61,40.09 21.22,40.7 U1.14
  Bottom Layer w0.254: v1(22.73,22.66) v1(17.29,22.66)
SD-CLK: length 30
  Top Layer w0.254: v1(42.04,59.36) 42.16,59.49 45.59,59.49 45.85,59.74 45.85,60.38 46.24,60.77 CARD1.5 ; U1.80 35.12,51.29 36.83,53.01 v1(36.83,55.04)
  Bottom Layer w0.254: v1(42.04,59.36) 37.21,59.36 36.83,58.98 v1(36.83,55.04)
SD-CMD: length 34.2
  Top Layer w0.254: v1(36.83,60.5) 36.83,56.57 36.19,55.93 34.04,55.93 33.62,55.51 U1.83 ; CARD1.3 54.72,62.92 45.72,62.92 45.21,62.41 45.21,60.88 44.83,60.5 v1(42.04,60.5)
  Bottom Layer w0.254: v1(36.83,60.5) v1(42.04,60.5)
SD-D0: length 33
  Top Layer w0.254: v1(45.47,58.6) 54.74,58.6 CARD1.7 ; 38.66,42.2 42.02,42.2 44.07,44.25 v1(45.97,44.25)
  Bottom Layer w0.254: v1(45.97,44.25) 45.11,44.25 44.86,44.5 44.86,57.99 v1(45.47,58.6)
SD-D1: length 30.2
  Top Layer w0.254: v1(45.47,57.45) 54.76,57.45 CARD1.8 ; 38.66,42.7 41.63,42.7 44.07,45.14 v1(45.97,45.14)
  Bottom Layer w0.254: v1(45.97,45.14) 45.47,45.64 v1(45.47,57.45)
SD-D2: length 33.3
  Top Layer w0.254: U1.78 36.12,50.64 38.23,52.76 v1(38.23,62.92) ; v1(42.04,62.92) 43.18,62.92 43.69,63.42 43.69,64.82 44.03,65.17 CARD1.1
  Bottom Layer w0.254: v1(38.23,62.92) v1(42.04,62.92)
SD-D3: length 32.9
  Top Layer w0.254: v1(42.04,61.65) 44.07,61.65 44.45,62.03 44.45,63.8 44.7,64.06 54.76,64.06 CARD1.2 ; U1.79 35.62,50.91 37.59,52.88 v1(37.59,61.65)
  Bottom Layer w0.254: v1(37.59,61.65) v1(42.04,61.65)
SWCLK: length 21.2
  Top Layer w0.305: H1.3 38.61,66.22 40.13,64.69 40.13,56.18 38.86,54.91 38.86,49.58 38.03,48.75 U1.76
SWDIO: length 24.7
  Top Layer w0.305: H1.2 41.15,57.71 42.16,56.69 42.16,50.98 41.15,49.96 41.15,46.41 40.44,45.7 38.66,45.7
$1N655: length 13.5
  Top Layer w0.305: R8.2 16,32.07 16,35.74 17.46,37.2 U1.21
$1N662: length 7.7
  Top Layer w0.305: U1.49 36.62,30.24 37.23,29.63 C4.2
$1N663: length 7.1
  Top Layer w0.305: 38.66,46.2 40.05,46.2 40.39,46.53 C5.2
$1N4147: length 7.7
  Top Layer w0.254: R9.1 11.68,15.04 11.3,14.66 9.78,14.66 8.28,13.16 U2.B5
$1N4148: length 13.4
  Top Layer w0.254: U2.A5 9.76,16.16 10.03,16.43 10.03,20.37 10.41,20.75 14.22,20.75 14.61,20.37 R10.1
$1N4676: length 3.4
  Top Layer w0.254: PWR-Orange.2 25.09,19.66 R11.2
$1N5858: length 6.5
  Top Layer w0.254: R14.1 34.93,17.7 34.54,17.32 32,17.32 31.68,17 LED2.2
$1N5884: length 6.5
  Top Layer w0.254: LED3.2 37.63,15.32 38.23,15.93 R15.1
$1N5886: length 6.4
  Top Layer w0.254: LED1.2 28.32,17.95 29.21,18.85 31.48,18.85 R13.1

## Copper pours and planes (outline as drawn; the poured copper is in the pictures)
GND on Top Layer: 0,72.69 67.69,72.69 67.69,-0.08 0,-0.08
GND on Bottom Layer: 0,72.69 67.69,72.69 67.69,-0.08 0,-0.08

Small or netless copper shapes (teardrops, artwork), in the pictures only: 258 on Top Layer, 94 on Bottom Layer

## Text on the board
Bottom Silkscreen Layer: PD5 | PD4 | PD3 | PB9 | PB8 | PA4 | PA6 | PA8 | PE6 | PE5 | PB6 | PE4 | PE1 | PE0 | PC7 | PC6 | PD6 | PD7 | QinYuYQY.
Top Silkscreen Layer: PA2-U2T | PA3-U2R | PA10-U1R | PA9-U1T | PB5 | PB7 | PC15 | PC13 | PC14 | GND | PD5 | PD4 | PD3 | PB9 | PB8 | PA4 | PC5 | PA6 | PA8 | PC4 | PE6 | PE5 | PE9 | PB6 | PE4 | PE8 | PE10 | PE1 | PE0 | PE7 | PE11 | PC7 | PC6 | PE12 | PD6 | PD7 | PB1 | CLK | DIO | 3V3 | PD14 | PD13 | PD12 | PB13 | PB15 | PD11 | PD10 | PB12 | PD9 | PB14 | PE13 | PE14 | PE15 | PB10 | PB11 | stm32f407ve
